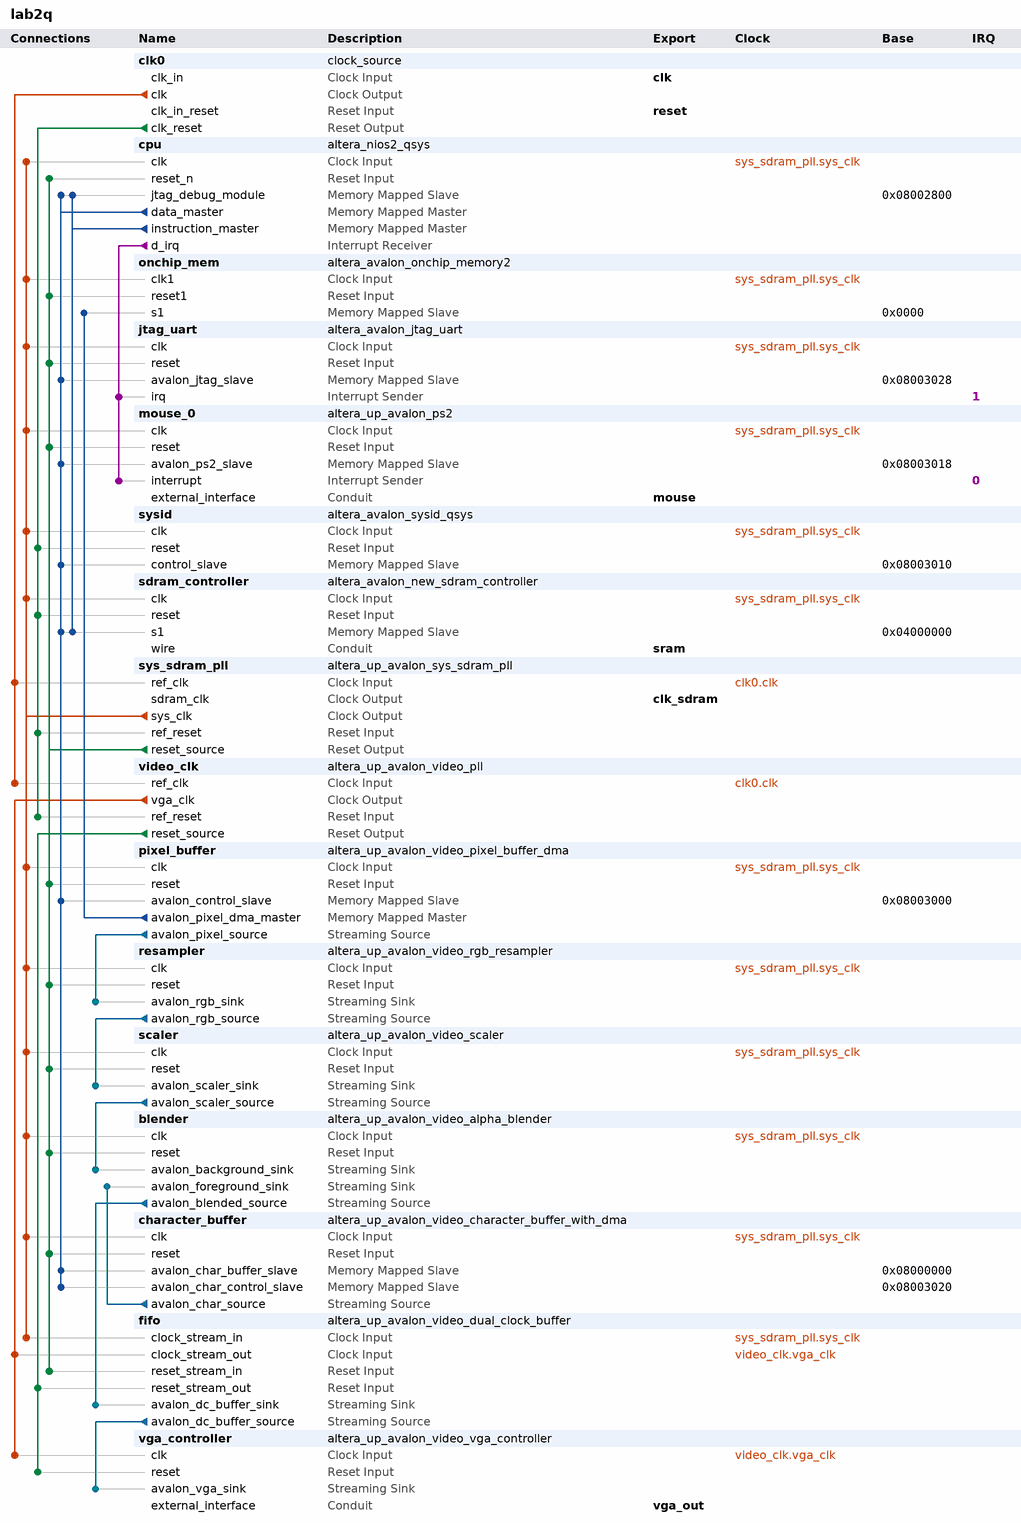
[diagram p0: system contents]
# Platform Designer (Qsys) system lab2q, Cyclone V 5CSEMA6F31C6
# Parameters at their usual value, and those the tool derives, are not listed.
package require -exact qsys 14.0
create_system lab2q
set_project_property DEVICE_FAMILY {Cyclone V}
set_project_property DEVICE 5CSEMA6F31C6

add_instance clk0 clock_source 14.1
set_instance_parameter_value clk0 clockFrequency 50000000

add_instance cpu altera_nios2_qsys 14.1
set_instance_parameter_value cpu breakSlave cpu.jtag_debug_module
set_instance_parameter_value cpu exceptionSlave sdram_controller.s1
set_instance_parameter_value cpu icache_size 2048
set_instance_parameter_value cpu impl Tiny
set_instance_parameter_value cpu mmu_TLBMissExcSlave None
set_instance_parameter_value cpu resetSlave sdram_controller.s1
set_instance_parameter_value cpu resetrequest_enabled true

add_instance onchip_mem altera_avalon_onchip_memory2 14.1
set_instance_parameter_value onchip_mem dataWidth 32
set_instance_parameter_value onchip_mem dualPort false
set_instance_parameter_value onchip_mem initMemContent true
set_instance_parameter_value onchip_mem initializationFileName onchip_mem.hex
set_instance_parameter_value onchip_mem memorySize 256000

add_instance jtag_uart altera_avalon_jtag_uart 14.1
set_instance_parameter_value jtag_uart simInteractiveOptions NO_INTERACTIVE_WINDOWS

add_instance mouse_0 altera_up_avalon_ps2 14.0

add_instance sysid altera_avalon_sysid_qsys 14.1
set_instance_parameter_value sysid id 1

add_instance sdram_controller altera_avalon_new_sdram_controller 14.1
set_instance_parameter_value sdram_controller TAC 5.4
set_instance_parameter_value sdram_controller TRCD 15.0
set_instance_parameter_value sdram_controller TRP 15.0
set_instance_parameter_value sdram_controller casLatency 3
set_instance_parameter_value sdram_controller columnWidth 10
set_instance_parameter_value sdram_controller dataWidth 16
set_instance_parameter_value sdram_controller generateSimulationModel false
set_instance_parameter_value sdram_controller model single_Micron_MT48LC4M32B2_7_chip
set_instance_parameter_value sdram_controller numberOfBanks 4
set_instance_parameter_value sdram_controller numberOfChipSelects 1
set_instance_parameter_value sdram_controller powerUpDelay 100.0
set_instance_parameter_value sdram_controller refreshPeriod 7.8125
set_instance_parameter_value sdram_controller rowWidth 13

add_instance sys_sdram_pll altera_up_avalon_sys_sdram_pll 14.0
set_instance_parameter_value sys_sdram_pll CV_boards DE1-SoC
set_instance_parameter_value sys_sdram_pll gui_outclk 50.0
set_instance_parameter_value sys_sdram_pll gui_refclk 50.0

add_instance video_clk altera_up_avalon_video_pll 14.0
set_instance_parameter_value video_clk camera {5MP Digital Camera}
set_instance_parameter_value video_clk gui_refclk 50.0
set_instance_parameter_value video_clk lcd {7" LCD on VEEK-MT and MTL Module}
set_instance_parameter_value video_clk video_in_clk_en true

add_instance pixel_buffer altera_up_avalon_video_pixel_buffer_dma 14.0
set_instance_parameter_value pixel_buffer addr_mode X-Y
set_instance_parameter_value pixel_buffer back_start_address 0
set_instance_parameter_value pixel_buffer color_space {16-bit RGB}
set_instance_parameter_value pixel_buffer image_height 480
set_instance_parameter_value pixel_buffer image_width 640
set_instance_parameter_value pixel_buffer start_address 0

add_instance resampler altera_up_avalon_video_rgb_resampler 14.0
set_instance_parameter_value resampler alpha 1
set_instance_parameter_value resampler input_type {16-bit RGB}
set_instance_parameter_value resampler output_type {30-bit RGB}

add_instance scaler altera_up_avalon_video_scaler 14.0
set_instance_parameter_value scaler color_bits 10
set_instance_parameter_value scaler color_planes 3
set_instance_parameter_value scaler height_in 480
set_instance_parameter_value scaler height_scaling 1
set_instance_parameter_value scaler width_in 640
set_instance_parameter_value scaler width_scaling 0.5

add_instance blender altera_up_avalon_video_alpha_blender 14.0

add_instance character_buffer altera_up_avalon_video_character_buffer_with_dma 14.0
set_instance_parameter_value character_buffer enable_transparency true

add_instance fifo altera_up_avalon_video_dual_clock_buffer 14.0
set_instance_parameter_value fifo color_bits 10

add_instance vga_controller altera_up_avalon_video_vga_controller 14.0
set_instance_parameter_value vga_controller board DE1-SoC
set_instance_parameter_value vga_controller resolution {VGA 640x480}

# connections
add_connection clk0.clk sys_sdram_pll.ref_clk clock
add_connection clk0.clk video_clk.ref_clk clock
add_connection sys_sdram_pll.sys_clk blender.clk clock
add_connection sys_sdram_pll.sys_clk character_buffer.clk clock
add_connection sys_sdram_pll.sys_clk cpu.clk clock
add_connection sys_sdram_pll.sys_clk fifo.clock_stream_in clock
add_connection sys_sdram_pll.sys_clk jtag_uart.clk clock
add_connection sys_sdram_pll.sys_clk mouse_0.clk clock
add_connection sys_sdram_pll.sys_clk onchip_mem.clk1 clock
add_connection sys_sdram_pll.sys_clk pixel_buffer.clk clock
add_connection sys_sdram_pll.sys_clk resampler.clk clock
add_connection sys_sdram_pll.sys_clk scaler.clk clock
add_connection sys_sdram_pll.sys_clk sdram_controller.clk clock
add_connection sys_sdram_pll.sys_clk sysid.clk clock
add_connection video_clk.vga_clk fifo.clock_stream_out clock
add_connection video_clk.vga_clk vga_controller.clk clock
add_connection clk0.clk_reset sdram_controller.reset reset
add_connection clk0.clk_reset sys_sdram_pll.ref_reset reset
add_connection clk0.clk_reset sysid.reset reset
add_connection clk0.clk_reset video_clk.ref_reset reset
add_connection sys_sdram_pll.reset_source blender.reset reset
add_connection sys_sdram_pll.reset_source character_buffer.reset reset
add_connection sys_sdram_pll.reset_source cpu.reset_n reset
add_connection sys_sdram_pll.reset_source fifo.reset_stream_in reset
add_connection sys_sdram_pll.reset_source jtag_uart.reset reset
add_connection sys_sdram_pll.reset_source mouse_0.reset reset
add_connection sys_sdram_pll.reset_source onchip_mem.reset1 reset
add_connection sys_sdram_pll.reset_source pixel_buffer.reset reset
add_connection sys_sdram_pll.reset_source resampler.reset reset
add_connection sys_sdram_pll.reset_source scaler.reset reset
add_connection video_clk.reset_source fifo.reset_stream_out reset
add_connection video_clk.reset_source vga_controller.reset reset
add_connection cpu.data_master character_buffer.avalon_char_buffer_slave avalon
set_connection_parameter_value cpu.data_master/character_buffer.avalon_char_buffer_slave baseAddress 0x08000000
add_connection cpu.data_master character_buffer.avalon_char_control_slave avalon
set_connection_parameter_value cpu.data_master/character_buffer.avalon_char_control_slave baseAddress 0x08003020
add_connection cpu.data_master cpu.jtag_debug_module avalon
set_connection_parameter_value cpu.data_master/cpu.jtag_debug_module baseAddress 0x08002800
add_connection cpu.data_master jtag_uart.avalon_jtag_slave avalon
set_connection_parameter_value cpu.data_master/jtag_uart.avalon_jtag_slave baseAddress 0x08003028
add_connection cpu.data_master mouse_0.avalon_ps2_slave avalon
set_connection_parameter_value cpu.data_master/mouse_0.avalon_ps2_slave baseAddress 0x08003018
add_connection cpu.data_master pixel_buffer.avalon_control_slave avalon
set_connection_parameter_value cpu.data_master/pixel_buffer.avalon_control_slave baseAddress 0x08003000
add_connection cpu.data_master sdram_controller.s1 avalon
set_connection_parameter_value cpu.data_master/sdram_controller.s1 baseAddress 0x04000000
add_connection cpu.data_master sysid.control_slave avalon
set_connection_parameter_value cpu.data_master/sysid.control_slave baseAddress 0x08003010
add_connection cpu.instruction_master cpu.jtag_debug_module avalon
set_connection_parameter_value cpu.instruction_master/cpu.jtag_debug_module baseAddress 0x08002800
add_connection cpu.instruction_master sdram_controller.s1 avalon
set_connection_parameter_value cpu.instruction_master/sdram_controller.s1 baseAddress 0x04000000
add_connection pixel_buffer.avalon_pixel_dma_master onchip_mem.s1 avalon
set_connection_parameter_value pixel_buffer.avalon_pixel_dma_master/onchip_mem.s1 baseAddress 0x0000
add_connection blender.avalon_blended_source fifo.avalon_dc_buffer_sink avalon_streaming
add_connection character_buffer.avalon_char_source blender.avalon_foreground_sink avalon_streaming
add_connection fifo.avalon_dc_buffer_source vga_controller.avalon_vga_sink avalon_streaming
add_connection pixel_buffer.avalon_pixel_source resampler.avalon_rgb_sink avalon_streaming
add_connection resampler.avalon_rgb_source scaler.avalon_scaler_sink avalon_streaming
add_connection scaler.avalon_scaler_source blender.avalon_background_sink avalon_streaming
add_connection cpu.d_irq jtag_uart.irq interrupt
set_connection_parameter_value cpu.d_irq/jtag_uart.irq irqNumber 1
add_connection cpu.d_irq mouse_0.interrupt interrupt
set_connection_parameter_value cpu.d_irq/mouse_0.interrupt irqNumber 0

# exported interfaces
add_interface clk clock sink
set_interface_property clk EXPORT_OF clk0.clk_in
add_interface clk_sdram clock source
set_interface_property clk_sdram EXPORT_OF sys_sdram_pll.sdram_clk
add_interface mouse conduit end
set_interface_property mouse EXPORT_OF mouse_0.external_interface
add_interface reset reset sink
set_interface_property reset EXPORT_OF clk0.clk_in_reset
add_interface sram conduit end
set_interface_property sram EXPORT_OF sdram_controller.wire
add_interface vga_out conduit end
set_interface_property vga_out EXPORT_OF vga_controller.external_interface

set_interconnect_requirement {$system} qsys_mm.clockCrossingAdapter HANDSHAKE
set_interconnect_requirement {$system} qsys_mm.insertDefaultSlave FALSE
set_interconnect_requirement {$system} qsys_mm.maxAdditionalLatency 1

save_system lab2q.qsys
